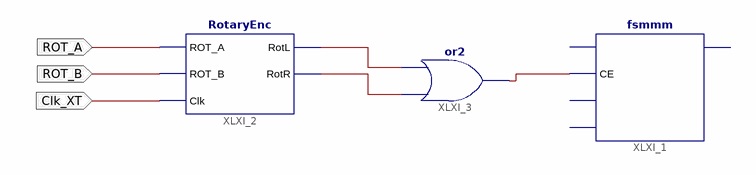
[diagram p0: schematic sheet 1]
// Xilinx ISE schematic schem.sch (xc9500xl) as structural Verilog: 3 symbols, 3 ports
module schem (
  input  ROT_A,
  input  ROT_B,
  input  Clk_XT
);

  wire XLXN_4, XLXN_5, XLXN_8;

  fsmmm XLXI_1 (.CE(XLXN_8));  // open: X, CLK, RST, Y
  RotaryEnc XLXI_2 (.ROT_A(ROT_A), .ROT_B(ROT_B), .RotL(XLXN_4), .RotR(XLXN_5), .Clk(Clk_XT));
  or XLXI_3 (XLXN_8, XLXN_5, XLXN_4);
endmodule
